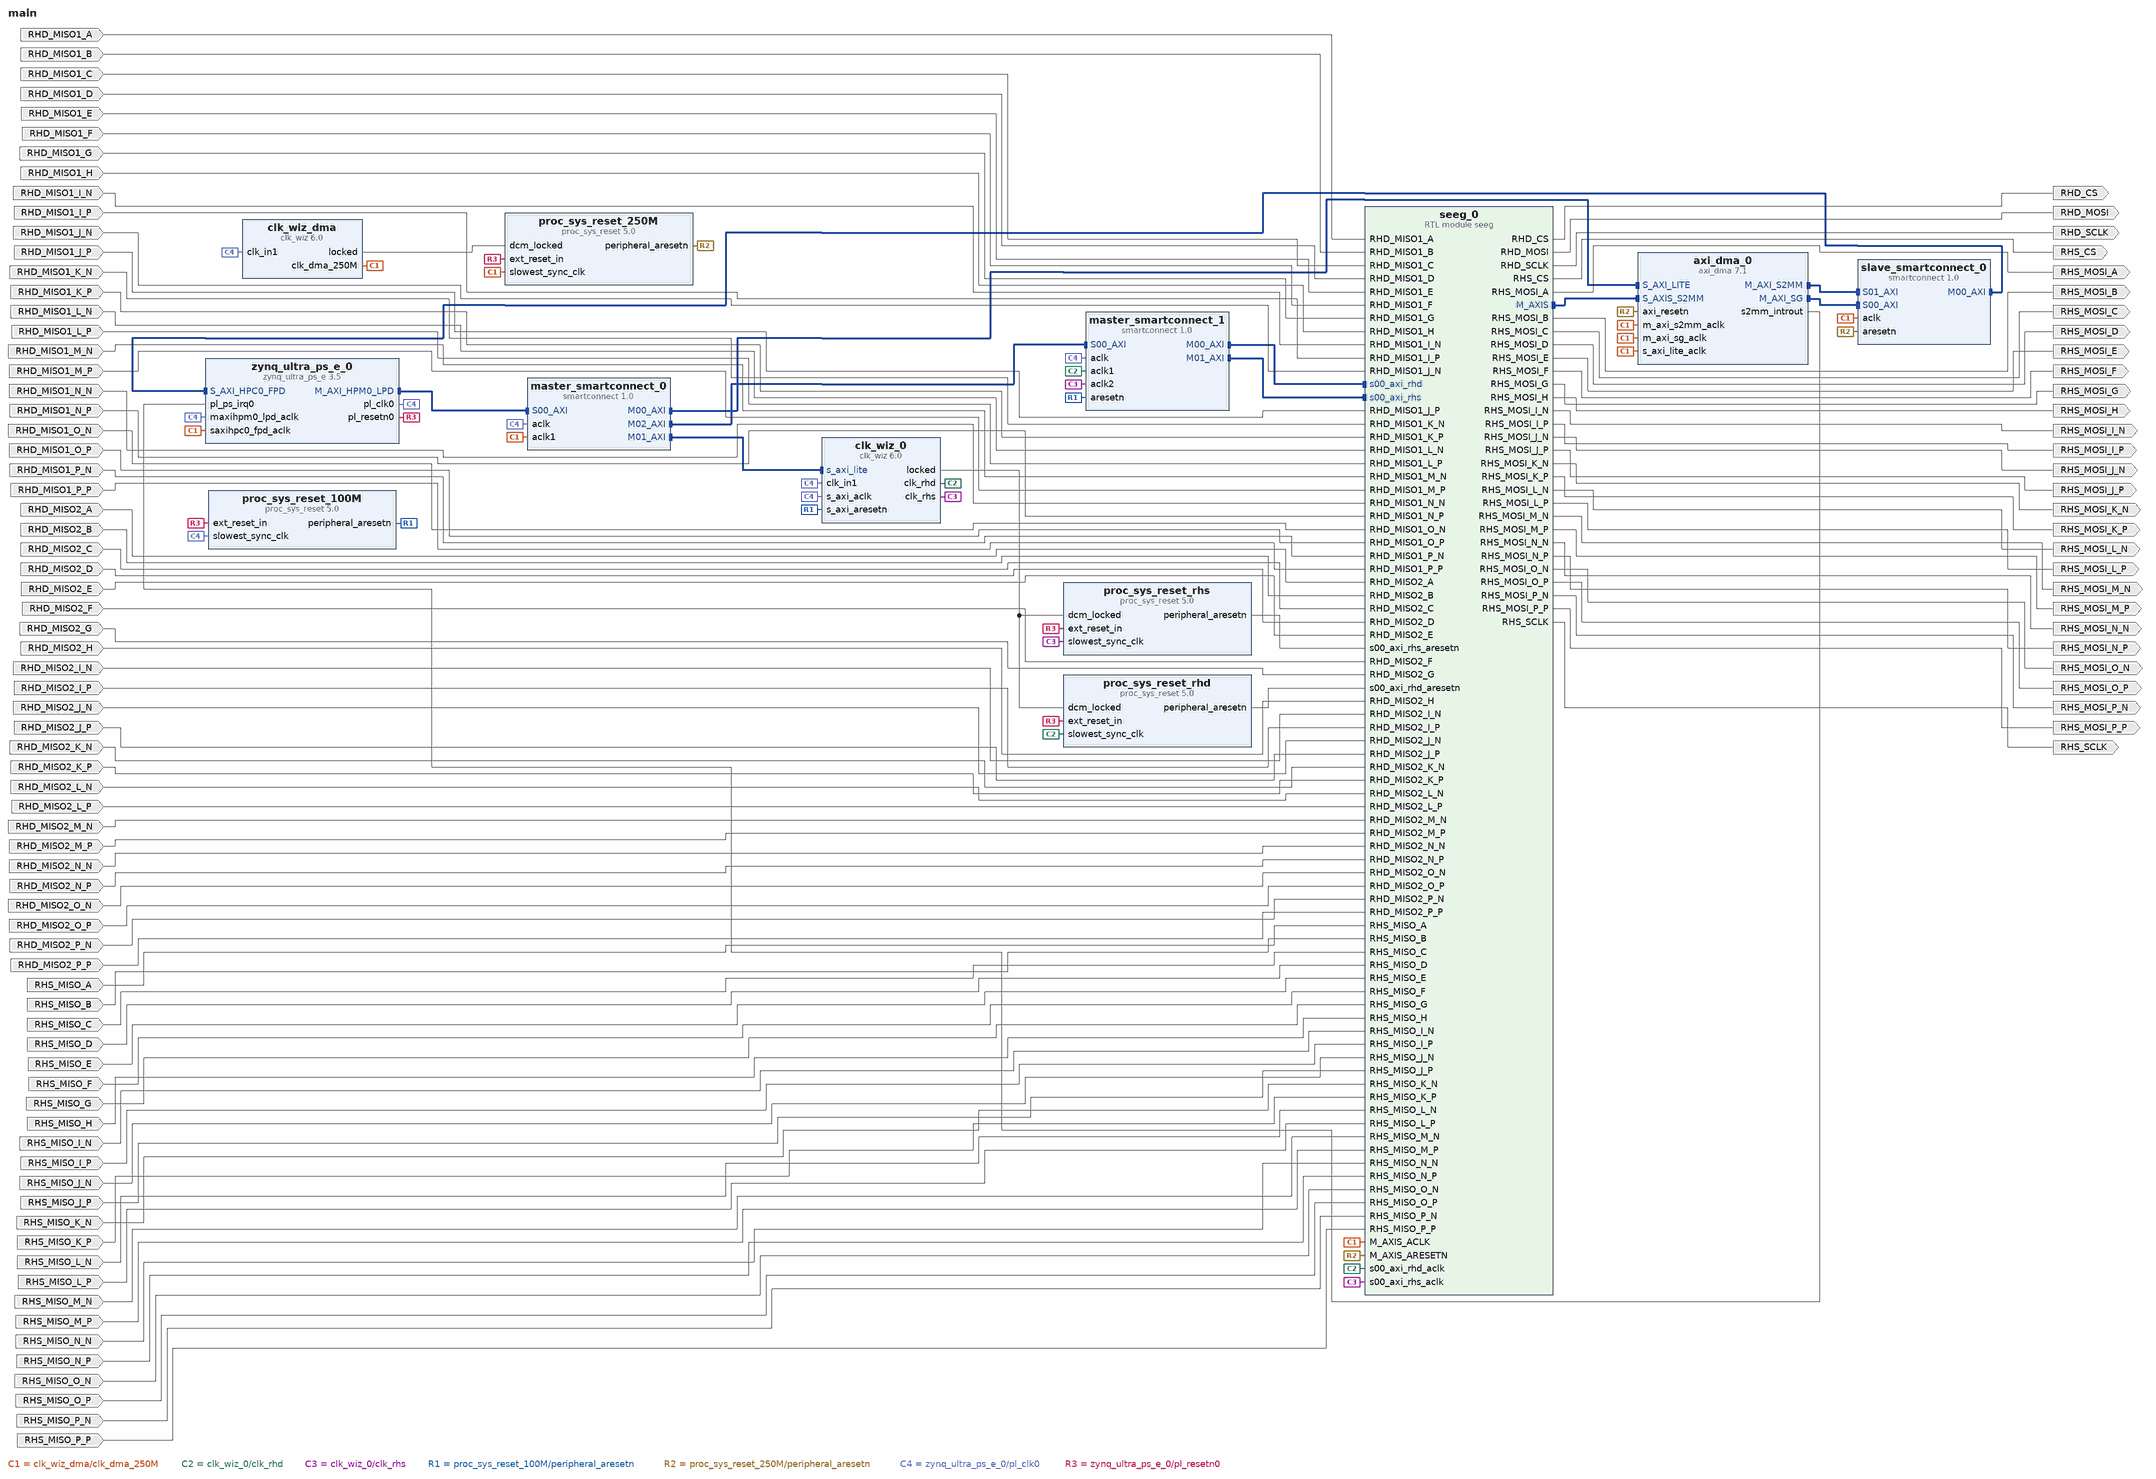
[diagram p0: block diagram of the top level]
# Vivado block design main, xck26-sfvc784-2LV-c, Vivado 2023.1
create_bd_design main

create_bd_port -dir O RHD_CS
create_bd_port -dir O RHD_MOSI
create_bd_port -dir O RHD_SCLK
create_bd_port -dir O RHS_CS
create_bd_port -dir O RHS_SCLK
create_bd_port -dir O RHS_MOSI_A
create_bd_port -dir O RHS_MOSI_B
create_bd_port -dir O RHS_MOSI_C
create_bd_port -dir O RHS_MOSI_D
create_bd_port -dir O RHS_MOSI_E
create_bd_port -dir O RHS_MOSI_F
create_bd_port -dir O RHS_MOSI_G
create_bd_port -dir O RHS_MOSI_H
create_bd_port -dir I RHD_MISO1_A
create_bd_port -dir I RHD_MISO2_A
create_bd_port -dir I RHD_MISO1_B
create_bd_port -dir I RHD_MISO2_B
create_bd_port -dir I RHD_MISO1_C
create_bd_port -dir I RHD_MISO2_C
create_bd_port -dir I RHD_MISO1_D
create_bd_port -dir I RHD_MISO2_D
create_bd_port -dir I RHD_MISO1_E
create_bd_port -dir I RHD_MISO2_E
create_bd_port -dir I RHD_MISO1_F
create_bd_port -dir I RHD_MISO2_F
create_bd_port -dir I RHD_MISO1_G
create_bd_port -dir I RHD_MISO2_G
create_bd_port -dir I RHD_MISO1_H
create_bd_port -dir I RHD_MISO2_H
create_bd_port -dir I RHD_MISO1_I_P
create_bd_port -dir I RHD_MISO1_I_N
create_bd_port -dir I RHD_MISO2_I_P
create_bd_port -dir I RHD_MISO2_I_N
create_bd_port -dir I RHD_MISO1_J_P
create_bd_port -dir I RHD_MISO1_J_N
create_bd_port -dir I RHD_MISO2_J_P
create_bd_port -dir I RHD_MISO2_J_N
create_bd_port -dir I RHD_MISO1_K_P
create_bd_port -dir I RHD_MISO1_K_N
create_bd_port -dir I RHD_MISO2_K_P
create_bd_port -dir I RHD_MISO2_K_N
create_bd_port -dir I RHD_MISO1_L_P
create_bd_port -dir I RHD_MISO1_L_N
create_bd_port -dir I RHD_MISO2_L_P
create_bd_port -dir I RHD_MISO2_L_N
create_bd_port -dir I RHD_MISO1_M_P
create_bd_port -dir I RHD_MISO1_M_N
create_bd_port -dir I RHD_MISO2_M_P
create_bd_port -dir I RHD_MISO2_M_N
create_bd_port -dir I RHD_MISO1_N_P
create_bd_port -dir I RHD_MISO1_N_N
create_bd_port -dir I RHD_MISO2_N_P
create_bd_port -dir I RHD_MISO2_N_N
create_bd_port -dir I RHD_MISO1_O_P
create_bd_port -dir I RHD_MISO1_O_N
create_bd_port -dir I RHD_MISO2_O_P
create_bd_port -dir I RHD_MISO2_O_N
create_bd_port -dir I RHD_MISO1_P_P
create_bd_port -dir I RHD_MISO1_P_N
create_bd_port -dir I RHD_MISO2_P_P
create_bd_port -dir I RHD_MISO2_P_N
create_bd_port -dir I RHS_MISO_A
create_bd_port -dir I RHS_MISO_B
create_bd_port -dir I RHS_MISO_C
create_bd_port -dir I RHS_MISO_D
create_bd_port -dir I RHS_MISO_E
create_bd_port -dir I RHS_MISO_F
create_bd_port -dir I RHS_MISO_G
create_bd_port -dir I RHS_MISO_H
create_bd_port -dir I RHS_MISO_I_P
create_bd_port -dir I RHS_MISO_I_N
create_bd_port -dir I RHS_MISO_J_P
create_bd_port -dir I RHS_MISO_J_N
create_bd_port -dir I RHS_MISO_K_P
create_bd_port -dir I RHS_MISO_K_N
create_bd_port -dir I RHS_MISO_L_P
create_bd_port -dir I RHS_MISO_L_N
create_bd_port -dir I RHS_MISO_M_P
create_bd_port -dir I RHS_MISO_M_N
create_bd_port -dir I RHS_MISO_N_P
create_bd_port -dir I RHS_MISO_N_N
create_bd_port -dir I RHS_MISO_O_P
create_bd_port -dir I RHS_MISO_O_N
create_bd_port -dir I RHS_MISO_P_P
create_bd_port -dir I RHS_MISO_P_N
create_bd_port -dir O RHS_MOSI_I_P
create_bd_port -dir O RHS_MOSI_I_N
create_bd_port -dir O RHS_MOSI_J_P
create_bd_port -dir O RHS_MOSI_J_N
create_bd_port -dir O RHS_MOSI_K_P
create_bd_port -dir O RHS_MOSI_K_N
create_bd_port -dir O RHS_MOSI_L_P
create_bd_port -dir O RHS_MOSI_L_N
create_bd_port -dir O RHS_MOSI_M_P
create_bd_port -dir O RHS_MOSI_M_N
create_bd_port -dir O RHS_MOSI_N_P
create_bd_port -dir O RHS_MOSI_N_N
create_bd_port -dir O RHS_MOSI_O_P
create_bd_port -dir O RHS_MOSI_O_N
create_bd_port -dir O RHS_MOSI_P_P
create_bd_port -dir O RHS_MOSI_P_N

create_bd_cell -type ip -vlnv xilinx.com:ip:zynq_ultra_ps_e:3.5 zynq_ultra_ps_e_0
set_property -dict [list \
  CONFIG.PSU_BANK_0_IO_STANDARD LVCMOS18 \
  CONFIG.PSU_BANK_1_IO_STANDARD LVCMOS18 \
  CONFIG.PSU_BANK_2_IO_STANDARD LVCMOS18 \
  CONFIG.PSU_BANK_3_IO_STANDARD LVCMOS18 \
  CONFIG.PSU_USB3__DUAL_CLOCK_ENABLE 1 \
  CONFIG.PSU__CAN1__PERIPHERAL__ENABLE 0 \
  CONFIG.PSU__CRF_APB__ACPU_CTRL__FREQMHZ 1333.333 \
  CONFIG.PSU__CRF_APB__ACPU_CTRL__SRCSEL APLL \
  CONFIG.PSU__CRF_APB__APLL_CTRL__SRCSEL PSS_REF_CLK \
  CONFIG.PSU__CRF_APB__APLL_FRAC_CFG__ENABLED 1 \
  CONFIG.PSU__CRF_APB__DBG_FPD_CTRL__FREQMHZ 250 \
  CONFIG.PSU__CRF_APB__DBG_FPD_CTRL__SRCSEL IOPLL \
  CONFIG.PSU__CRF_APB__DBG_TRACE_CTRL__FREQMHZ 250 \
  CONFIG.PSU__CRF_APB__DBG_TRACE_CTRL__SRCSEL IOPLL \
  CONFIG.PSU__CRF_APB__DBG_TSTMP_CTRL__FREQMHZ 250 \
  CONFIG.PSU__CRF_APB__DBG_TSTMP_CTRL__SRCSEL IOPLL \
  CONFIG.PSU__CRF_APB__DDR_CTRL__FREQMHZ 1200 \
  CONFIG.PSU__CRF_APB__DDR_CTRL__SRCSEL DPLL \
  CONFIG.PSU__CRF_APB__DPDMA_REF_CTRL__FREQMHZ 600 \
  CONFIG.PSU__CRF_APB__DPDMA_REF_CTRL__SRCSEL APLL \
  CONFIG.PSU__CRF_APB__DPLL_CTRL__SRCSEL PSS_REF_CLK \
  CONFIG.PSU__CRF_APB__DP_AUDIO_REF_CTRL__SRCSEL RPLL \
  CONFIG.PSU__CRF_APB__DP_STC_REF_CTRL__SRCSEL RPLL \
  CONFIG.PSU__CRF_APB__DP_VIDEO_REF_CTRL__SRCSEL VPLL \
  CONFIG.PSU__CRF_APB__GDMA_REF_CTRL__FREQMHZ 600 \
  CONFIG.PSU__CRF_APB__GDMA_REF_CTRL__SRCSEL DPLL \
  CONFIG.PSU__CRF_APB__GPU_REF_CTRL__FREQMHZ 600 \
  CONFIG.PSU__CRF_APB__GPU_REF_CTRL__SRCSEL IOPLL \
  CONFIG.PSU__CRF_APB__TOPSW_LSBUS_CTRL__FREQMHZ 100 \
  CONFIG.PSU__CRF_APB__TOPSW_LSBUS_CTRL__SRCSEL IOPLL \
  CONFIG.PSU__CRF_APB__TOPSW_MAIN_CTRL__FREQMHZ 533.33 \
  CONFIG.PSU__CRF_APB__TOPSW_MAIN_CTRL__SRCSEL DPLL \
  CONFIG.PSU__CRF_APB__VPLL_CTRL__SRCSEL PSS_REF_CLK \
  CONFIG.PSU__CRL_APB__ADMA_REF_CTRL__FREQMHZ 500 \
  CONFIG.PSU__CRL_APB__ADMA_REF_CTRL__SRCSEL IOPLL \
  CONFIG.PSU__CRL_APB__CAN1_REF_CTRL__FREQMHZ 100 \
  CONFIG.PSU__CRL_APB__CAN1_REF_CTRL__SRCSEL IOPLL \
  CONFIG.PSU__CRL_APB__CPU_R5_CTRL__FREQMHZ 533.333 \
  CONFIG.PSU__CRL_APB__CPU_R5_CTRL__SRCSEL RPLL \
  CONFIG.PSU__CRL_APB__DBG_LPD_CTRL__FREQMHZ 250 \
  CONFIG.PSU__CRL_APB__DBG_LPD_CTRL__SRCSEL IOPLL \
  CONFIG.PSU__CRL_APB__GEM3_REF_CTRL__FREQMHZ 125 \
  CONFIG.PSU__CRL_APB__GEM3_REF_CTRL__SRCSEL IOPLL \
  CONFIG.PSU__CRL_APB__I2C0_REF_CTRL__FREQMHZ 100 \
  CONFIG.PSU__CRL_APB__I2C0_REF_CTRL__SRCSEL IOPLL \
  CONFIG.PSU__CRL_APB__I2C1_REF_CTRL__FREQMHZ 100 \
  CONFIG.PSU__CRL_APB__I2C1_REF_CTRL__SRCSEL IOPLL \
  CONFIG.PSU__CRL_APB__IOPLL_CTRL__SRCSEL PSS_REF_CLK \
  CONFIG.PSU__CRL_APB__IOU_SWITCH_CTRL__FREQMHZ 250 \
  CONFIG.PSU__CRL_APB__IOU_SWITCH_CTRL__SRCSEL IOPLL \
  CONFIG.PSU__CRL_APB__LPD_LSBUS_CTRL__FREQMHZ 100 \
  CONFIG.PSU__CRL_APB__LPD_LSBUS_CTRL__SRCSEL IOPLL \
  CONFIG.PSU__CRL_APB__LPD_SWITCH_CTRL__FREQMHZ 500 \
  CONFIG.PSU__CRL_APB__LPD_SWITCH_CTRL__SRCSEL IOPLL \
  CONFIG.PSU__CRL_APB__PCAP_CTRL__FREQMHZ 200 \
  CONFIG.PSU__CRL_APB__PCAP_CTRL__SRCSEL IOPLL \
  CONFIG.PSU__CRL_APB__PL0_REF_CTRL__FREQMHZ 100 \
  CONFIG.PSU__CRL_APB__PL0_REF_CTRL__SRCSEL IOPLL \
  CONFIG.PSU__CRL_APB__QSPI_REF_CTRL__FREQMHZ 125 \
  CONFIG.PSU__CRL_APB__QSPI_REF_CTRL__SRCSEL IOPLL \
  CONFIG.PSU__CRL_APB__RPLL_CTRL__SRCSEL PSS_REF_CLK \
  CONFIG.PSU__CRL_APB__SDIO0_REF_CTRL__SRCSEL IOPLL \
  CONFIG.PSU__CRL_APB__SDIO1_REF_CTRL__FREQMHZ 200 \
  CONFIG.PSU__CRL_APB__SDIO1_REF_CTRL__SRCSEL IOPLL \
  CONFIG.PSU__CRL_APB__SPI1_REF_CTRL__SRCSEL IOPLL \
  CONFIG.PSU__CRL_APB__TIMESTAMP_REF_CTRL__FREQMHZ 100 \
  CONFIG.PSU__CRL_APB__TIMESTAMP_REF_CTRL__SRCSEL IOPLL \
  CONFIG.PSU__CRL_APB__UART0_REF_CTRL__FREQMHZ 100 \
  CONFIG.PSU__CRL_APB__UART0_REF_CTRL__SRCSEL IOPLL \
  CONFIG.PSU__CRL_APB__UART1_REF_CTRL__FREQMHZ 100 \
  CONFIG.PSU__CRL_APB__UART1_REF_CTRL__SRCSEL IOPLL \
  CONFIG.PSU__CRL_APB__USB0_BUS_REF_CTRL__FREQMHZ 250 \
  CONFIG.PSU__CRL_APB__USB0_BUS_REF_CTRL__SRCSEL IOPLL \
  CONFIG.PSU__CRL_APB__USB3_DUAL_REF_CTRL__FREQMHZ 20 \
  CONFIG.PSU__CRL_APB__USB3_DUAL_REF_CTRL__SRCSEL IOPLL \
  CONFIG.PSU__CRL_APB__USB3__ENABLE 1 \
  CONFIG.PSU__CSUPMU__PERIPHERAL__VALID 1 \
  CONFIG.PSU__DDRC__BUS_WIDTH {64 Bit} \
  CONFIG.PSU__DDRC__COMPONENTS Components \
  CONFIG.PSU__DDRC__DEVICE_CAPACITY {8192 MBits} \
  CONFIG.PSU__DDRC__DRAM_WIDTH {16 Bits} \
  CONFIG.PSU__DDRC__ECC Disabled \
  CONFIG.PSU__DDRC__MEMORY_TYPE {DDR 4} \
  CONFIG.PSU__DDRC__SPEED_BIN DDR4_2400R \
  CONFIG.PSU__DDR_HIGH_ADDRESS_GUI_ENABLE 1 \
  CONFIG.PSU__DDR__INTERFACE__FREQMHZ 600.000 \
  CONFIG.PSU__DLL__ISUSED 1 \
  CONFIG.PSU__FPGA_PL0_ENABLE 1 \
  CONFIG.PSU__GPIO0_MIO__IO {MIO 0 .. 25} \
  CONFIG.PSU__GPIO0_MIO__PERIPHERAL__ENABLE 1 \
  CONFIG.PSU__GPIO1_MIO__PERIPHERAL__ENABLE 0 \
  CONFIG.PSU__GPIO_EMIO_WIDTH 4 \
  CONFIG.PSU__GPIO_EMIO__PERIPHERAL__ENABLE 1 \
  CONFIG.PSU__GPIO_EMIO__PERIPHERAL__IO 4 \
  CONFIG.PSU__I2C0__PERIPHERAL__ENABLE 0 \
  CONFIG.PSU__I2C1__PERIPHERAL__ENABLE 1 \
  CONFIG.PSU__I2C1__PERIPHERAL__IO {MIO 24 .. 25} \
  CONFIG.PSU__IOU_SLCR__IOU_TTC_APB_CLK__TTC0_SEL APB \
  CONFIG.PSU__IOU_SLCR__IOU_TTC_APB_CLK__TTC1_SEL APB \
  CONFIG.PSU__IOU_SLCR__IOU_TTC_APB_CLK__TTC2_SEL APB \
  CONFIG.PSU__IOU_SLCR__IOU_TTC_APB_CLK__TTC3_SEL APB \
  CONFIG.PSU__OVERRIDE__BASIC_CLOCK 0 \
  CONFIG.PSU__PCIE__AER_CAPABILITY 1 \
  CONFIG.PSU__PCIE__BAR0_VAL 0x0 \
  CONFIG.PSU__PCIE__BAR1_VAL 0x0 \
  CONFIG.PSU__PCIE__BAR2_VAL 0x0 \
  CONFIG.PSU__PCIE__BAR3_VAL 0x0 \
  CONFIG.PSU__PCIE__BAR4_VAL 0x0 \
  CONFIG.PSU__PCIE__BAR5_VAL 0x0 \
  CONFIG.PSU__PCIE__CLASS_CODE_BASE 0x06 \
  CONFIG.PSU__PCIE__CLASS_CODE_INTERFACE 0x0 \
  CONFIG.PSU__PCIE__CLASS_CODE_SUB 0x4 \
  CONFIG.PSU__PCIE__CLASS_CODE_VALUE 0x60400 \
  CONFIG.PSU__PCIE__CRS_SW_VISIBILITY 1 \
  CONFIG.PSU__PCIE__DEVICE_ID 0xD011 \
  CONFIG.PSU__PCIE__DEVICE_PORT_TYPE {Root Port} \
  CONFIG.PSU__PCIE__EROM_VAL 0x0 \
  CONFIG.PSU__PCIE__INTX_GENERATION 1 \
  CONFIG.PSU__PCIE__LANE0__ENABLE 1 \
  CONFIG.PSU__PCIE__LANE0__IO {GT Lane0} \
  CONFIG.PSU__PCIE__LINK_SPEED {5.0 Gb/s} \
  CONFIG.PSU__PCIE__MAXIMUM_LINK_WIDTH x1 \
  CONFIG.PSU__PCIE__MAX_PAYLOAD_SIZE {256 bytes} \
  CONFIG.PSU__PCIE__PERIPHERAL__ENABLE 1 \
  CONFIG.PSU__PCIE__PERIPHERAL__ENDPOINT_ENABLE 0 \
  CONFIG.PSU__PCIE__PERIPHERAL__ROOTPORT_ENABLE 1 \
  CONFIG.PSU__PCIE__PERIPHERAL__ROOTPORT_IO {MIO 30} \
  CONFIG.PSU__PCIE__REF_CLK_FREQ 100 \
  CONFIG.PSU__PCIE__REF_CLK_SEL {Ref Clk1} \
  CONFIG.PSU__PCIE__REVISION_ID 0x0 \
  CONFIG.PSU__PCIE__SUBSYSTEM_ID 0x7 \
  CONFIG.PSU__PCIE__SUBSYSTEM_VENDOR_ID 0x10EE \
  CONFIG.PSU__PCIE__VENDOR_ID 0x10EE \
  CONFIG.PSU__PMU_COHERENCY 0 \
  CONFIG.PSU__PMU__AIBACK__ENABLE 0 \
  CONFIG.PSU__PMU__EMIO_GPI__ENABLE 0 \
  CONFIG.PSU__PMU__EMIO_GPO__ENABLE 0 \
  CONFIG.PSU__PMU__GPI0__ENABLE 0 \
  CONFIG.PSU__PMU__GPI1__ENABLE 0 \
  CONFIG.PSU__PMU__GPI2__ENABLE 0 \
  CONFIG.PSU__PMU__GPI3__ENABLE 0 \
  CONFIG.PSU__PMU__GPI4__ENABLE 0 \
  CONFIG.PSU__PMU__GPI5__ENABLE 1 \
  CONFIG.PSU__PMU__GPI5__IO {MIO 31} \
  CONFIG.PSU__PMU__GPO0__ENABLE 0 \
  CONFIG.PSU__PMU__GPO1__ENABLE 0 \
  CONFIG.PSU__PMU__GPO2__ENABLE 0 \
  CONFIG.PSU__PMU__GPO3__ENABLE 1 \
  CONFIG.PSU__PMU__GPO3__IO {MIO 35} \
  CONFIG.PSU__PMU__GPO3__POLARITY low \
  CONFIG.PSU__PMU__GPO4__ENABLE 0 \
  CONFIG.PSU__PMU__GPO5__ENABLE 0 \
  CONFIG.PSU__PMU__PERIPHERAL__ENABLE 1 \
  CONFIG.PSU__PMU__PLERROR__ENABLE 0 \
  CONFIG.PSU__PRESET_APPLIED 1 \
  CONFIG.PSU__PSS_REF_CLK__FREQMHZ 33.333 \
  CONFIG.PSU__QSPI_COHERENCY 0 \
  CONFIG.PSU__QSPI_ROUTE_THROUGH_FPD 0 \
  CONFIG.PSU__QSPI__GRP_FBCLK__ENABLE 0 \
  CONFIG.PSU__QSPI__PERIPHERAL__DATA_MODE x4 \
  CONFIG.PSU__QSPI__PERIPHERAL__ENABLE 1 \
  CONFIG.PSU__QSPI__PERIPHERAL__IO {MIO 0 .. 5} \
  CONFIG.PSU__QSPI__PERIPHERAL__MODE Single \
  CONFIG.PSU__SD0__CLK_100_SDR_OTAP_DLY 0x3 \
  CONFIG.PSU__SD0__CLK_200_SDR_OTAP_DLY 0x3 \
  CONFIG.PSU__SD0__CLK_50_DDR_ITAP_DLY 0x3D \
  CONFIG.PSU__SD0__CLK_50_DDR_OTAP_DLY 0x4 \
  CONFIG.PSU__SD0__CLK_50_SDR_ITAP_DLY 0x15 \
  CONFIG.PSU__SD0__CLK_50_SDR_OTAP_DLY 0x5 \
  CONFIG.PSU__SD0__RESET__ENABLE 1 \
  CONFIG.PSU__SD1_COHERENCY 0 \
  CONFIG.PSU__SD1_ROUTE_THROUGH_FPD 0 \
  CONFIG.PSU__SD1__CLK_50_SDR_ITAP_DLY 0x15 \
  CONFIG.PSU__SD1__CLK_50_SDR_OTAP_DLY 0x5 \
  CONFIG.PSU__SD1__DATA_TRANSFER_MODE 4Bit \
  CONFIG.PSU__SD1__GRP_CD__ENABLE 1 \
  CONFIG.PSU__SD1__GRP_CD__IO {MIO 45} \
  CONFIG.PSU__SD1__GRP_POW__ENABLE 1 \
  CONFIG.PSU__SD1__GRP_POW__IO {MIO 43} \
  CONFIG.PSU__SD1__GRP_WP__ENABLE 0 \
  CONFIG.PSU__SD1__PERIPHERAL__ENABLE 1 \
  CONFIG.PSU__SD1__PERIPHERAL__IO {MIO 46 .. 51} \
  CONFIG.PSU__SD1__SLOT_TYPE {SD 2.0} \
  CONFIG.PSU__SPI1__GRP_SS0__IO {MIO 9} \
  CONFIG.PSU__SPI1__PERIPHERAL__ENABLE 1 \
  CONFIG.PSU__SPI1__PERIPHERAL__IO {MIO 6 .. 11} \
  CONFIG.PSU__SWDT0__CLOCK__ENABLE 0 \
  CONFIG.PSU__SWDT0__PERIPHERAL__ENABLE 1 \
  CONFIG.PSU__SWDT0__RESET__ENABLE 0 \
  CONFIG.PSU__SWDT1__CLOCK__ENABLE 0 \
  CONFIG.PSU__SWDT1__PERIPHERAL__ENABLE 1 \
  CONFIG.PSU__SWDT1__RESET__ENABLE 0 \
  CONFIG.PSU__TTC0__CLOCK__ENABLE 0 \
  CONFIG.PSU__TTC0__PERIPHERAL__ENABLE 1 \
  CONFIG.PSU__TTC0__WAVEOUT__ENABLE 0 \
  CONFIG.PSU__TTC1__CLOCK__ENABLE 0 \
  CONFIG.PSU__TTC1__PERIPHERAL__ENABLE 1 \
  CONFIG.PSU__TTC1__WAVEOUT__ENABLE 0 \
  CONFIG.PSU__TTC2__CLOCK__ENABLE 0 \
  CONFIG.PSU__TTC2__PERIPHERAL__ENABLE 1 \
  CONFIG.PSU__TTC2__WAVEOUT__ENABLE 0 \
  CONFIG.PSU__TTC3__CLOCK__ENABLE 0 \
  CONFIG.PSU__TTC3__PERIPHERAL__ENABLE 1 \
  CONFIG.PSU__TTC3__WAVEOUT__ENABLE 0 \
  CONFIG.PSU__UART0__BAUD_RATE 115200 \
  CONFIG.PSU__UART0__MODEM__ENABLE 0 \
  CONFIG.PSU__UART0__PERIPHERAL__ENABLE 1 \
  CONFIG.PSU__UART0__PERIPHERAL__IO {MIO 26 .. 27} \
  CONFIG.PSU__UART1__BAUD_RATE 115200 \
  CONFIG.PSU__UART1__MODEM__ENABLE 0 \
  CONFIG.PSU__UART1__PERIPHERAL__ENABLE 1 \
  CONFIG.PSU__UART1__PERIPHERAL__IO {MIO 36 .. 37} \
  CONFIG.PSU__USB0_COHERENCY 0 \
  CONFIG.PSU__USB0__PERIPHERAL__ENABLE 1 \
  CONFIG.PSU__USB0__PERIPHERAL__IO {MIO 52 .. 63} \
  CONFIG.PSU__USB0__REF_CLK_FREQ 26 \
  CONFIG.PSU__USB0__REF_CLK_SEL {Ref Clk0} \
  CONFIG.PSU__USB0__RESET__ENABLE 1 \
  CONFIG.PSU__USB0__RESET__IO {MIO 44} \
  CONFIG.PSU__USB1__PERIPHERAL__ENABLE 1 \
  CONFIG.PSU__USB1__PERIPHERAL__IO {MIO 64 .. 75} \
  CONFIG.PSU__USB2_0__EMIO__ENABLE 0 \
  CONFIG.PSU__USB3_0__EMIO__ENABLE 0 \
  CONFIG.PSU__USB3_0__PERIPHERAL__ENABLE 1 \
  CONFIG.PSU__USB3_0__PERIPHERAL__IO {GT Lane2} \
  CONFIG.PSU__USB__RESET__MODE {Shared MIO Pin} \
  CONFIG.PSU__USB__RESET__POLARITY {Active Low} \
  CONFIG.PSU__USE__IRQ0 1 \
  CONFIG.PSU__USE__M_AXI_GP0 0 \
  CONFIG.PSU__USE__M_AXI_GP1 0 \
  CONFIG.PSU__USE__M_AXI_GP2 1 \
  CONFIG.PSU__USE__S_AXI_GP0 1 \
] [get_bd_cells zynq_ultra_ps_e_0]
# 270 more settings of zynq_ultra_ps_e_0 are not shown: defaults, MIO pin electricals, DDR timing, and values the tool derives
create_bd_cell -type ip -vlnv xilinx.com:ip:smartconnect:1.0 master_smartconnect_0
set_property -dict {CONFIG.NUM_CLKS 2 CONFIG.NUM_MI 3 CONFIG.NUM_SI 1} [get_bd_cells master_smartconnect_0]
create_bd_cell -type ip -vlnv xilinx.com:ip:proc_sys_reset:5.0 proc_sys_reset_100M
create_bd_cell -type ip -vlnv xilinx.com:ip:smartconnect:1.0 master_smartconnect_1
set_property -dict {CONFIG.NUM_CLKS 3 CONFIG.NUM_MI 2 CONFIG.NUM_SI 1} [get_bd_cells master_smartconnect_1]
create_bd_cell -type ip -vlnv xilinx.com:ip:clk_wiz:6.0 clk_wiz_0
set_property -dict [list \
  CONFIG.CLKOUT1_JITTER 459.729 \
  CONFIG.CLKOUT1_PHASE_ERROR 310.959 \
  CONFIG.CLKOUT1_REQUESTED_OUT_FREQ 7 \
  CONFIG.CLKOUT2_JITTER 317.080 \
  CONFIG.CLKOUT2_PHASE_ERROR 310.959 \
  CONFIG.CLKOUT2_REQUESTED_OUT_FREQ 56 \
  CONFIG.CLKOUT2_USED true \
  CONFIG.CLK_OUT1_PORT clk_rhd \
  CONFIG.CLK_OUT2_PORT clk_rhs \
  CONFIG.MMCM_CLKFBOUT_MULT_F 42.000 \
  CONFIG.MMCM_CLKOUT0_DIVIDE_F 120.000 \
  CONFIG.MMCM_CLKOUT1_DIVIDE 15 \
  CONFIG.MMCM_DIVCLK_DIVIDE 5 \
  CONFIG.NUM_OUT_CLKS 2 \
  CONFIG.PRIM_SOURCE Global_buffer \
  CONFIG.USE_DYN_RECONFIG true \
] [get_bd_cells clk_wiz_0]
create_bd_cell -type ip -vlnv xilinx.com:ip:proc_sys_reset:5.0 proc_sys_reset_rhd
create_bd_cell -type ip -vlnv xilinx.com:ip:proc_sys_reset:5.0 proc_sys_reset_rhs
create_bd_cell -type ip -vlnv xilinx.com:ip:smartconnect:1.0 slave_smartconnect_0
create_bd_cell -type ip -vlnv xilinx.com:ip:axi_dma:7.1 axi_dma_0
set_property -dict [list \
  CONFIG.c_addr_width 64 \
  CONFIG.c_include_mm2s 0 \
  CONFIG.c_m_axi_s2mm_data_width 64 \
  CONFIG.c_s2mm_burst_size 256 \
  CONFIG.c_s_axis_s2mm_tdata_width 64 \
  CONFIG.c_sg_include_stscntrl_strm 0 \
  CONFIG.c_sg_length_width 26 \
] [get_bd_cells axi_dma_0]
create_bd_cell -type ip -vlnv xilinx.com:ip:proc_sys_reset:5.0 proc_sys_reset_250M
create_bd_cell -type ip -vlnv xilinx.com:ip:clk_wiz:6.0 clk_wiz_dma
set_property -dict [list \
  CONFIG.CLKIN2_JITTER_PS 100.0 \
  CONFIG.CLKOUT1_JITTER 110.210 \
  CONFIG.CLKOUT1_PHASE_ERROR 98.576 \
  CONFIG.CLKOUT1_REQUESTED_OUT_FREQ 250 \
  CONFIG.CLK_OUT1_PORT clk_dma_250M \
  CONFIG.ENABLE_CLOCK_MONITOR false \
  CONFIG.MMCM_CLKFBOUT_MULT_F 10.000 \
  CONFIG.MMCM_CLKIN2_PERIOD 10.000 \
  CONFIG.MMCM_CLKOUT0_DIVIDE_F 4.000 \
  CONFIG.OPTIMIZE_CLOCKING_STRUCTURE_EN false \
  CONFIG.PRIMITIVE MMCM \
  CONFIG.PRIM_SOURCE Global_buffer \
  CONFIG.SECONDARY_SOURCE Single_ended_clock_capable_pin \
  CONFIG.USE_INCLK_SWITCHOVER false \
  CONFIG.USE_LOCKED true \
  CONFIG.USE_RESET false \
] [get_bd_cells clk_wiz_dma]
create_bd_cell -type module -reference seeg seeg_0

# ---- connections ----

connect_bd_intf_net [get_bd_intf_pins axi_dma_0/M_AXI_S2MM] [get_bd_intf_pins slave_smartconnect_0/S01_AXI]
connect_bd_intf_net [get_bd_intf_pins axi_dma_0/M_AXI_SG] [get_bd_intf_pins slave_smartconnect_0/S00_AXI]
connect_bd_intf_net [get_bd_intf_pins axi_dma_0/S_AXI_LITE] [get_bd_intf_pins master_smartconnect_0/M00_AXI]
connect_bd_intf_net [get_bd_intf_pins master_smartconnect_0/M01_AXI] [get_bd_intf_pins clk_wiz_0/s_axi_lite]
connect_bd_intf_net [get_bd_intf_pins master_smartconnect_0/M02_AXI] [get_bd_intf_pins master_smartconnect_1/S00_AXI]
connect_bd_intf_net [get_bd_intf_pins master_smartconnect_1/M00_AXI] [get_bd_intf_pins seeg_0/s00_axi_rhd]
connect_bd_intf_net [get_bd_intf_pins master_smartconnect_1/M01_AXI] [get_bd_intf_pins seeg_0/s00_axi_rhs]
connect_bd_intf_net [get_bd_intf_pins seeg_0/M_AXIS] [get_bd_intf_pins axi_dma_0/S_AXIS_S2MM]
connect_bd_intf_net -intf_net smartconnect_0_M00_AXI [get_bd_intf_pins slave_smartconnect_0/M00_AXI] [get_bd_intf_pins zynq_ultra_ps_e_0/S_AXI_HPC0_FPD]
connect_bd_intf_net [get_bd_intf_pins zynq_ultra_ps_e_0/M_AXI_HPM0_LPD] [get_bd_intf_pins master_smartconnect_0/S00_AXI]
connect_bd_net [get_bd_pins clk_wiz_dma/clk_dma_250M] \
  [get_bd_pins zynq_ultra_ps_e_0/saxihpc0_fpd_aclk] [get_bd_pins slave_smartconnect_0/aclk] \
  [get_bd_pins axi_dma_0/s_axi_lite_aclk] [get_bd_pins axi_dma_0/m_axi_sg_aclk] [get_bd_pins axi_dma_0/m_axi_s2mm_aclk] \
  [get_bd_pins proc_sys_reset_250M/slowest_sync_clk] [get_bd_pins master_smartconnect_0/aclk1] \
  [get_bd_pins seeg_0/M_AXIS_ACLK]
connect_bd_net [get_bd_pins clk_wiz_0/locked] [get_bd_pins proc_sys_reset_rhs/dcm_locked] [get_bd_pins proc_sys_reset_rhd/dcm_locked]
connect_bd_net [get_bd_ports RHD_MISO1_A] [get_bd_pins seeg_0/RHD_MISO1_A]
connect_bd_net [get_bd_ports RHD_MISO1_B] [get_bd_pins seeg_0/RHD_MISO1_B]
connect_bd_net [get_bd_ports RHD_MISO1_C] [get_bd_pins seeg_0/RHD_MISO1_C]
connect_bd_net [get_bd_ports RHD_MISO1_D] [get_bd_pins seeg_0/RHD_MISO1_D]
connect_bd_net [get_bd_ports RHD_MISO1_E] [get_bd_pins seeg_0/RHD_MISO1_E]
connect_bd_net [get_bd_ports RHD_MISO1_F] [get_bd_pins seeg_0/RHD_MISO1_F]
connect_bd_net [get_bd_ports RHD_MISO1_G] [get_bd_pins seeg_0/RHD_MISO1_G]
connect_bd_net [get_bd_ports RHD_MISO1_H] [get_bd_pins seeg_0/RHD_MISO1_H]
connect_bd_net [get_bd_ports RHD_MISO1_I_N] [get_bd_pins seeg_0/RHD_MISO1_I_N]
connect_bd_net [get_bd_ports RHD_MISO1_I_P] [get_bd_pins seeg_0/RHD_MISO1_I_P]
connect_bd_net [get_bd_ports RHD_MISO1_J_N] [get_bd_pins seeg_0/RHD_MISO1_J_N]
connect_bd_net [get_bd_ports RHD_MISO1_J_P] [get_bd_pins seeg_0/RHD_MISO1_J_P]
connect_bd_net [get_bd_ports RHD_MISO1_K_N] [get_bd_pins seeg_0/RHD_MISO1_K_N]
connect_bd_net [get_bd_ports RHD_MISO1_K_P] [get_bd_pins seeg_0/RHD_MISO1_K_P]
connect_bd_net [get_bd_ports RHD_MISO1_L_N] [get_bd_pins seeg_0/RHD_MISO1_L_N]
connect_bd_net [get_bd_ports RHD_MISO1_L_P] [get_bd_pins seeg_0/RHD_MISO1_L_P]
connect_bd_net [get_bd_ports RHD_MISO1_M_N] [get_bd_pins seeg_0/RHD_MISO1_M_N]
connect_bd_net [get_bd_ports RHD_MISO1_M_P] [get_bd_pins seeg_0/RHD_MISO1_M_P]
connect_bd_net [get_bd_ports RHD_MISO1_N_N] [get_bd_pins seeg_0/RHD_MISO1_N_N]
connect_bd_net [get_bd_ports RHD_MISO1_N_P] [get_bd_pins seeg_0/RHD_MISO1_N_P]
connect_bd_net [get_bd_ports RHD_MISO1_O_N] [get_bd_pins seeg_0/RHD_MISO1_O_N]
connect_bd_net [get_bd_ports RHD_MISO1_O_P] [get_bd_pins seeg_0/RHD_MISO1_O_P]
connect_bd_net [get_bd_ports RHD_MISO1_P_N] [get_bd_pins seeg_0/RHD_MISO1_P_N]
connect_bd_net [get_bd_ports RHD_MISO1_P_P] [get_bd_pins seeg_0/RHD_MISO1_P_P]
connect_bd_net [get_bd_ports RHD_MISO2_A] [get_bd_pins seeg_0/RHD_MISO2_A]
connect_bd_net [get_bd_ports RHD_MISO2_B] [get_bd_pins seeg_0/RHD_MISO2_B]
connect_bd_net [get_bd_ports RHD_MISO2_C] [get_bd_pins seeg_0/RHD_MISO2_C]
connect_bd_net [get_bd_ports RHD_MISO2_D] [get_bd_pins seeg_0/RHD_MISO2_D]
connect_bd_net [get_bd_ports RHD_MISO2_E] [get_bd_pins seeg_0/RHD_MISO2_E]
connect_bd_net [get_bd_ports RHD_MISO2_F] [get_bd_pins seeg_0/RHD_MISO2_F]
connect_bd_net [get_bd_ports RHD_MISO2_G] [get_bd_pins seeg_0/RHD_MISO2_G]
connect_bd_net [get_bd_ports RHD_MISO2_H] [get_bd_pins seeg_0/RHD_MISO2_H]
connect_bd_net [get_bd_ports RHD_MISO2_I_N] [get_bd_pins seeg_0/RHD_MISO2_I_N]
connect_bd_net [get_bd_ports RHD_MISO2_I_P] [get_bd_pins seeg_0/RHD_MISO2_I_P]
connect_bd_net [get_bd_ports RHD_MISO2_J_N] [get_bd_pins seeg_0/RHD_MISO2_J_N]
connect_bd_net [get_bd_ports RHD_MISO2_J_P] [get_bd_pins seeg_0/RHD_MISO2_J_P]
connect_bd_net [get_bd_ports RHD_MISO2_K_N] [get_bd_pins seeg_0/RHD_MISO2_K_N]
connect_bd_net [get_bd_ports RHD_MISO2_K_P] [get_bd_pins seeg_0/RHD_MISO2_K_P]
connect_bd_net [get_bd_ports RHD_MISO2_L_N] [get_bd_pins seeg_0/RHD_MISO2_L_N]
connect_bd_net [get_bd_ports RHD_MISO2_L_P] [get_bd_pins seeg_0/RHD_MISO2_L_P]
connect_bd_net [get_bd_ports RHD_MISO2_M_N] [get_bd_pins seeg_0/RHD_MISO2_M_N]
connect_bd_net [get_bd_ports RHD_MISO2_M_P] [get_bd_pins seeg_0/RHD_MISO2_M_P]
connect_bd_net [get_bd_ports RHD_MISO2_N_N] [get_bd_pins seeg_0/RHD_MISO2_N_N]
connect_bd_net [get_bd_ports RHD_MISO2_N_P] [get_bd_pins seeg_0/RHD_MISO2_N_P]
connect_bd_net [get_bd_ports RHD_MISO2_O_N] [get_bd_pins seeg_0/RHD_MISO2_O_N]
connect_bd_net [get_bd_ports RHD_MISO2_O_P] [get_bd_pins seeg_0/RHD_MISO2_O_P]
connect_bd_net [get_bd_ports RHD_MISO2_P_N] [get_bd_pins seeg_0/RHD_MISO2_P_N]
connect_bd_net [get_bd_ports RHD_MISO2_P_P] [get_bd_pins seeg_0/RHD_MISO2_P_P]
connect_bd_net [get_bd_ports RHS_MISO_A] [get_bd_pins seeg_0/RHS_MISO_A]
connect_bd_net [get_bd_ports RHS_MISO_B] [get_bd_pins seeg_0/RHS_MISO_B]
connect_bd_net [get_bd_ports RHS_MISO_C] [get_bd_pins seeg_0/RHS_MISO_C]
connect_bd_net [get_bd_ports RHS_MISO_D] [get_bd_pins seeg_0/RHS_MISO_D]
connect_bd_net [get_bd_ports RHS_MISO_E] [get_bd_pins seeg_0/RHS_MISO_E]
connect_bd_net [get_bd_ports RHS_MISO_F] [get_bd_pins seeg_0/RHS_MISO_F]
connect_bd_net [get_bd_ports RHS_MISO_G] [get_bd_pins seeg_0/RHS_MISO_G]
connect_bd_net [get_bd_ports RHS_MISO_H] [get_bd_pins seeg_0/RHS_MISO_H]
connect_bd_net [get_bd_ports RHS_MISO_I_N] [get_bd_pins seeg_0/RHS_MISO_I_N]
connect_bd_net [get_bd_ports RHS_MISO_I_P] [get_bd_pins seeg_0/RHS_MISO_I_P]
connect_bd_net [get_bd_ports RHS_MISO_J_N] [get_bd_pins seeg_0/RHS_MISO_J_N]
connect_bd_net [get_bd_ports RHS_MISO_J_P] [get_bd_pins seeg_0/RHS_MISO_J_P]
connect_bd_net [get_bd_ports RHS_MISO_K_N] [get_bd_pins seeg_0/RHS_MISO_K_N]
connect_bd_net [get_bd_ports RHS_MISO_K_P] [get_bd_pins seeg_0/RHS_MISO_K_P]
connect_bd_net [get_bd_ports RHS_MISO_L_N] [get_bd_pins seeg_0/RHS_MISO_L_N]
connect_bd_net [get_bd_ports RHS_MISO_L_P] [get_bd_pins seeg_0/RHS_MISO_L_P]
connect_bd_net [get_bd_ports RHS_MISO_M_N] [get_bd_pins seeg_0/RHS_MISO_M_N]
connect_bd_net [get_bd_ports RHS_MISO_M_P] [get_bd_pins seeg_0/RHS_MISO_M_P]
connect_bd_net [get_bd_ports RHS_MISO_N_N] [get_bd_pins seeg_0/RHS_MISO_N_N]
connect_bd_net [get_bd_ports RHS_MISO_N_P] [get_bd_pins seeg_0/RHS_MISO_N_P]
connect_bd_net [get_bd_ports RHS_MISO_O_N] [get_bd_pins seeg_0/RHS_MISO_O_N]
connect_bd_net [get_bd_ports RHS_MISO_O_P] [get_bd_pins seeg_0/RHS_MISO_O_P]
connect_bd_net [get_bd_ports RHS_MISO_P_N] [get_bd_pins seeg_0/RHS_MISO_P_N]
connect_bd_net [get_bd_ports RHS_MISO_P_P] [get_bd_pins seeg_0/RHS_MISO_P_P]
connect_bd_net [get_bd_pins axi_dma_0/s2mm_introut] [get_bd_pins zynq_ultra_ps_e_0/pl_ps_irq0]
connect_bd_net [get_bd_pins clk_wiz_0/clk_rhd] \
  [get_bd_pins master_smartconnect_1/aclk1] [get_bd_pins proc_sys_reset_rhd/slowest_sync_clk] \
  [get_bd_pins seeg_0/s00_axi_rhd_aclk]
connect_bd_net [get_bd_pins clk_wiz_0/clk_rhs] \
  [get_bd_pins proc_sys_reset_rhs/slowest_sync_clk] [get_bd_pins master_smartconnect_1/aclk2] \
  [get_bd_pins seeg_0/s00_axi_rhs_aclk]
connect_bd_net [get_bd_pins clk_wiz_dma/locked] [get_bd_pins proc_sys_reset_250M/dcm_locked]
connect_bd_net [get_bd_pins proc_sys_reset_100M/peripheral_aresetn] [get_bd_pins clk_wiz_0/s_axi_aresetn] [get_bd_pins master_smartconnect_1/aresetn]
connect_bd_net [get_bd_pins proc_sys_reset_250M/peripheral_aresetn] \
  [get_bd_pins axi_dma_0/axi_resetn] [get_bd_pins slave_smartconnect_0/aresetn] [get_bd_pins seeg_0/M_AXIS_ARESETN]
connect_bd_net [get_bd_pins proc_sys_reset_rhd/peripheral_aresetn] [get_bd_pins seeg_0/s00_axi_rhd_aresetn]
connect_bd_net [get_bd_pins proc_sys_reset_rhs/peripheral_aresetn] [get_bd_pins seeg_0/s00_axi_rhs_aresetn]
connect_bd_net [get_bd_pins seeg_0/RHD_CS] [get_bd_ports RHD_CS]
connect_bd_net [get_bd_pins seeg_0/RHD_MOSI] [get_bd_ports RHD_MOSI]
connect_bd_net [get_bd_pins seeg_0/RHD_SCLK] [get_bd_ports RHD_SCLK]
connect_bd_net [get_bd_pins seeg_0/RHS_CS] [get_bd_ports RHS_CS]
connect_bd_net [get_bd_pins seeg_0/RHS_MOSI_A] [get_bd_ports RHS_MOSI_A]
connect_bd_net [get_bd_pins seeg_0/RHS_MOSI_B] [get_bd_ports RHS_MOSI_B]
connect_bd_net [get_bd_pins seeg_0/RHS_MOSI_C] [get_bd_ports RHS_MOSI_C]
connect_bd_net [get_bd_pins seeg_0/RHS_MOSI_D] [get_bd_ports RHS_MOSI_D]
connect_bd_net [get_bd_pins seeg_0/RHS_MOSI_E] [get_bd_ports RHS_MOSI_E]
connect_bd_net [get_bd_pins seeg_0/RHS_MOSI_F] [get_bd_ports RHS_MOSI_F]
connect_bd_net [get_bd_pins seeg_0/RHS_MOSI_G] [get_bd_ports RHS_MOSI_G]
connect_bd_net [get_bd_pins seeg_0/RHS_MOSI_H] [get_bd_ports RHS_MOSI_H]
connect_bd_net [get_bd_pins seeg_0/RHS_MOSI_I_N] [get_bd_ports RHS_MOSI_I_N]
connect_bd_net [get_bd_pins seeg_0/RHS_MOSI_I_P] [get_bd_ports RHS_MOSI_I_P]
connect_bd_net [get_bd_pins seeg_0/RHS_MOSI_J_N] [get_bd_ports RHS_MOSI_J_N]
connect_bd_net [get_bd_pins seeg_0/RHS_MOSI_J_P] [get_bd_ports RHS_MOSI_J_P]
connect_bd_net [get_bd_pins seeg_0/RHS_MOSI_K_N] [get_bd_ports RHS_MOSI_K_N]
connect_bd_net [get_bd_pins seeg_0/RHS_MOSI_K_P] [get_bd_ports RHS_MOSI_K_P]
connect_bd_net [get_bd_pins seeg_0/RHS_MOSI_L_N] [get_bd_ports RHS_MOSI_L_N]
connect_bd_net [get_bd_pins seeg_0/RHS_MOSI_L_P] [get_bd_ports RHS_MOSI_L_P]
connect_bd_net [get_bd_pins seeg_0/RHS_MOSI_M_N] [get_bd_ports RHS_MOSI_M_N]
connect_bd_net [get_bd_pins seeg_0/RHS_MOSI_M_P] [get_bd_ports RHS_MOSI_M_P]
connect_bd_net [get_bd_pins seeg_0/RHS_MOSI_N_N] [get_bd_ports RHS_MOSI_N_N]
connect_bd_net [get_bd_pins seeg_0/RHS_MOSI_N_P] [get_bd_ports RHS_MOSI_N_P]
connect_bd_net [get_bd_pins seeg_0/RHS_MOSI_O_N] [get_bd_ports RHS_MOSI_O_N]
connect_bd_net [get_bd_pins seeg_0/RHS_MOSI_O_P] [get_bd_ports RHS_MOSI_O_P]
connect_bd_net [get_bd_pins seeg_0/RHS_MOSI_P_N] [get_bd_ports RHS_MOSI_P_N]
connect_bd_net [get_bd_pins seeg_0/RHS_MOSI_P_P] [get_bd_ports RHS_MOSI_P_P]
connect_bd_net [get_bd_pins seeg_0/RHS_SCLK] [get_bd_ports RHS_SCLK]
connect_bd_net [get_bd_pins zynq_ultra_ps_e_0/pl_clk0] \
  [get_bd_pins zynq_ultra_ps_e_0/maxihpm0_lpd_aclk] [get_bd_pins master_smartconnect_0/aclk] \
  [get_bd_pins proc_sys_reset_100M/slowest_sync_clk] [get_bd_pins clk_wiz_dma/clk_in1] \
  [get_bd_pins master_smartconnect_1/aclk] [get_bd_pins clk_wiz_0/s_axi_aclk] [get_bd_pins clk_wiz_0/clk_in1]
connect_bd_net [get_bd_pins zynq_ultra_ps_e_0/pl_resetn0] \
  [get_bd_pins proc_sys_reset_250M/ext_reset_in] [get_bd_pins proc_sys_reset_100M/ext_reset_in] \
  [get_bd_pins proc_sys_reset_rhd/ext_reset_in] [get_bd_pins proc_sys_reset_rhs/ext_reset_in]

# ---- address map ----
assign_bd_address -offset 0x0000000000000000 -range 2G -target_address_space [get_bd_addr_spaces axi_dma_0/Data_S2MM] [get_bd_addr_segs zynq_ultra_ps_e_0/SAXIGP0/HPC0_DDR_LOW]
assign_bd_address -offset 0x00000000C0000000 -range 512M -target_address_space [get_bd_addr_spaces axi_dma_0/Data_S2MM] [get_bd_addr_segs zynq_ultra_ps_e_0/SAXIGP0/HPC0_QSPI]
assign_bd_address -offset 0x0000000800000000 -range 32G -target_address_space [get_bd_addr_spaces axi_dma_0/Data_S2MM] [get_bd_addr_segs zynq_ultra_ps_e_0/SAXIGP0/HPC0_DDR_HIGH]
exclude_bd_addr_seg -offset 0x00000000E0000000 -range 256M -target_address_space [get_bd_addr_spaces axi_dma_0/Data_S2MM] [get_bd_addr_segs zynq_ultra_ps_e_0/SAXIGP0/HPC0_PCIE_LOW]
exclude_bd_addr_seg -offset 0x00000000FF000000 -range 16M -target_address_space [get_bd_addr_spaces axi_dma_0/Data_S2MM] [get_bd_addr_segs zynq_ultra_ps_e_0/SAXIGP0/HPC0_LPS_OCM]
assign_bd_address -offset 0x0000000000000000 -range 2G -target_address_space [get_bd_addr_spaces axi_dma_0/Data_SG] [get_bd_addr_segs zynq_ultra_ps_e_0/SAXIGP0/HPC0_DDR_LOW]
assign_bd_address -offset 0x00000000C0000000 -range 512M -target_address_space [get_bd_addr_spaces axi_dma_0/Data_SG] [get_bd_addr_segs zynq_ultra_ps_e_0/SAXIGP0/HPC0_QSPI]
assign_bd_address -offset 0x0000000800000000 -range 32G -target_address_space [get_bd_addr_spaces axi_dma_0/Data_SG] [get_bd_addr_segs zynq_ultra_ps_e_0/SAXIGP0/HPC0_DDR_HIGH]
exclude_bd_addr_seg -offset 0x00000000E0000000 -range 256M -target_address_space [get_bd_addr_spaces axi_dma_0/Data_SG] [get_bd_addr_segs zynq_ultra_ps_e_0/SAXIGP0/HPC0_PCIE_LOW]
exclude_bd_addr_seg -offset 0x00000000FF000000 -range 16M -target_address_space [get_bd_addr_spaces axi_dma_0/Data_SG] [get_bd_addr_segs zynq_ultra_ps_e_0/SAXIGP0/HPC0_LPS_OCM]
assign_bd_address -offset 0x0080000000 -range 64K -target_address_space [get_bd_addr_spaces zynq_ultra_ps_e_0/Data] [get_bd_addr_segs axi_dma_0/S_AXI_LITE/Reg]
assign_bd_address -offset 0x0080010000 -range 64K -target_address_space [get_bd_addr_spaces zynq_ultra_ps_e_0/Data] [get_bd_addr_segs seeg_0/s00_axi_rhd/reg0]
assign_bd_address -offset 0x0080020000 -range 64K -target_address_space [get_bd_addr_spaces zynq_ultra_ps_e_0/Data] [get_bd_addr_segs clk_wiz_0/s_axi_lite/Reg]
assign_bd_address -offset 0x0080030000 -range 64K -target_address_space [get_bd_addr_spaces zynq_ultra_ps_e_0/Data] [get_bd_addr_segs seeg_0/s00_axi_rhs/reg0]

validate_bd_design
save_bd_design
